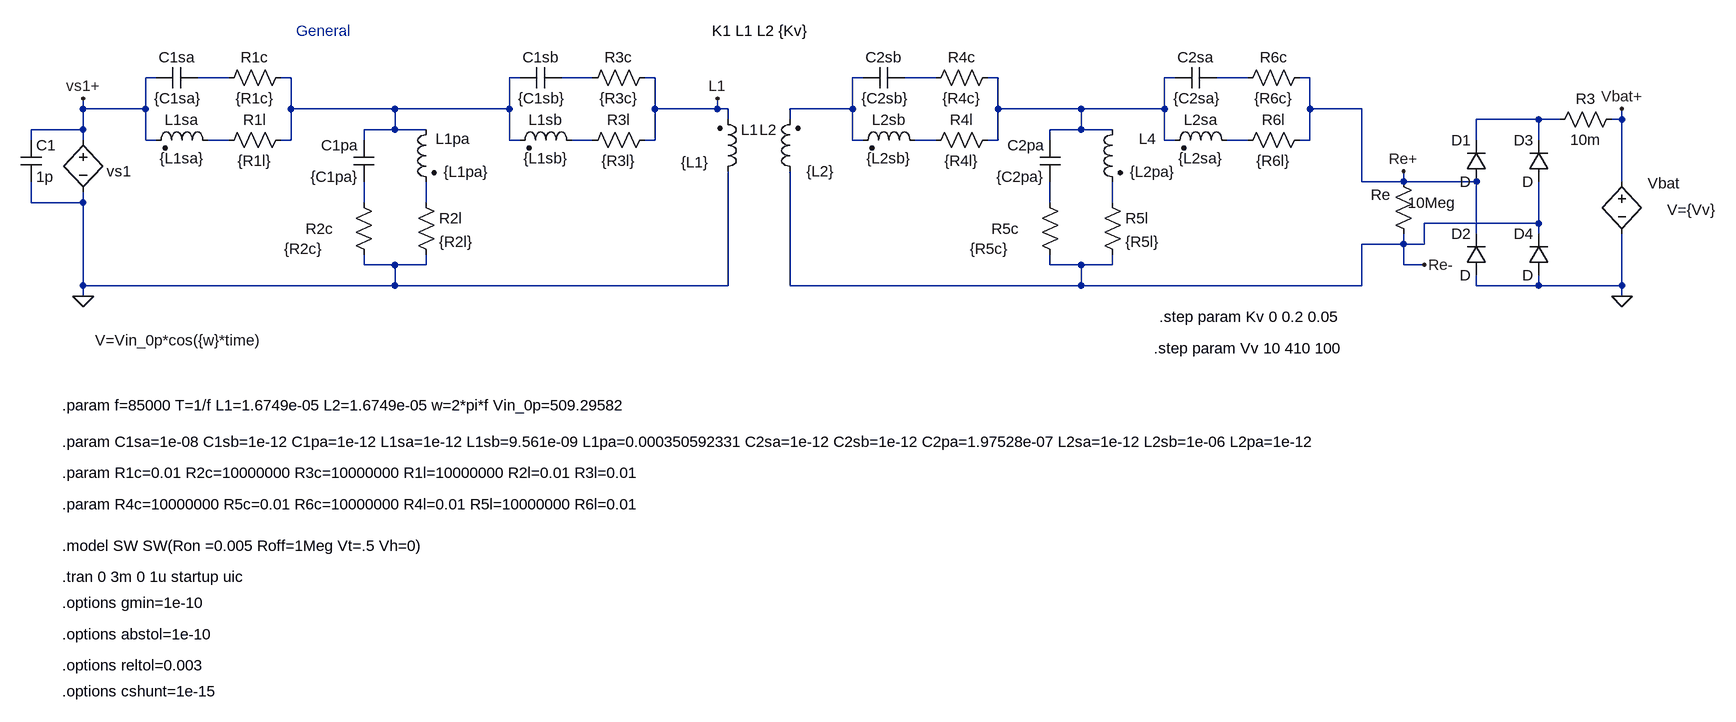
[diagram p0: schematic new_General_v4 (1).asc]
new_General_v4 (1).asc, the LTspice schematic file:
Version 4
SHEET 1 3372 844
WIRE -816 -784 -832 -784
WIRE -704 -784 -752 -784
WIRE -608 -784 -624 -784
WIRE -256 -784 -272 -784
WIRE -144 -784 -192 -784
WIRE -48 -784 -64 -784
WIRE 272 -784 256 -784
WIRE 384 -784 336 -784
WIRE 480 -784 464 -784
WIRE 752 -784 736 -784
WIRE 864 -784 816 -784
WIRE 960 -784 944 -784
WIRE -928 -736 -928 -752
WIRE -832 -736 -832 -784
WIRE -832 -736 -928 -736
WIRE -608 -736 -608 -784
WIRE -448 -736 -608 -736
WIRE -272 -736 -272 -784
WIRE -272 -736 -448 -736
WIRE -48 -736 -48 -784
WIRE 48 -736 48 -752
WIRE 48 -736 -48 -736
WIRE 64 -736 48 -736
WIRE 256 -736 256 -784
WIRE 256 -736 160 -736
WIRE 480 -736 480 -784
WIRE 608 -736 480 -736
WIRE 736 -736 736 -784
WIRE 736 -736 608 -736
WIRE 960 -736 960 -784
WIRE 1040 -736 960 -736
WIRE 64 -720 64 -736
WIRE 160 -720 160 -736
WIRE 1312 -720 1216 -720
WIRE 1344 -720 1312 -720
WIRE 1440 -720 1440 -736
WIRE 1440 -720 1424 -720
WIRE -928 -704 -928 -736
WIRE -928 -704 -1008 -704
WIRE -448 -704 -448 -736
WIRE -448 -704 -496 -704
WIRE -400 -704 -448 -704
WIRE 608 -704 608 -736
WIRE 608 -704 560 -704
WIRE 656 -704 608 -704
WIRE -1008 -688 -1008 -704
WIRE -928 -688 -928 -704
WIRE -832 -688 -832 -736
WIRE -816 -688 -832 -688
WIRE -704 -688 -736 -688
WIRE -608 -688 -608 -736
WIRE -608 -688 -624 -688
WIRE -496 -688 -496 -704
WIRE -272 -688 -272 -736
WIRE -256 -688 -272 -688
WIRE -144 -688 -176 -688
WIRE -48 -688 -48 -736
WIRE -48 -688 -64 -688
WIRE 256 -688 256 -736
WIRE 272 -688 256 -688
WIRE 384 -688 352 -688
WIRE 480 -688 480 -736
WIRE 480 -688 464 -688
WIRE 560 -688 560 -704
WIRE 736 -688 736 -736
WIRE 752 -688 736 -688
WIRE 864 -688 832 -688
WIRE 960 -688 960 -736
WIRE 960 -688 944 -688
WIRE 1216 -688 1216 -720
WIRE 1312 -688 1312 -720
WIRE 1040 -624 1040 -736
WIRE 1104 -624 1104 -640
WIRE 1104 -624 1040 -624
WIRE 1216 -624 1104 -624
WIRE 1440 -624 1440 -720
WIRE -1008 -592 -1008 -624
WIRE -928 -592 -928 -608
WIRE -928 -592 -1008 -592
WIRE -496 -592 -496 -624
WIRE -400 -592 -400 -624
WIRE 560 -592 560 -624
WIRE 656 -592 656 -624
WIRE 1312 -560 1312 -624
WIRE 1312 -560 1136 -560
WIRE 1216 -544 1216 -624
WIRE 1312 -544 1312 -560
WIRE 1104 -528 1104 -544
WIRE 1104 -528 1040 -528
WIRE 1136 -528 1136 -560
WIRE 1136 -528 1104 -528
WIRE -496 -496 -496 -512
WIRE -448 -496 -496 -496
WIRE -400 -496 -400 -512
WIRE -400 -496 -448 -496
WIRE 560 -496 560 -512
WIRE 608 -496 560 -496
WIRE 656 -496 656 -512
WIRE 656 -496 608 -496
WIRE 1104 -496 1104 -528
WIRE 1136 -496 1104 -496
WIRE -928 -464 -928 -592
WIRE -448 -464 -448 -496
WIRE -448 -464 -928 -464
WIRE 64 -464 64 -640
WIRE 64 -464 -448 -464
WIRE 160 -464 160 -640
WIRE 608 -464 608 -496
WIRE 608 -464 160 -464
WIRE 1040 -464 1040 -528
WIRE 1040 -464 608 -464
WIRE 1216 -464 1216 -480
WIRE 1312 -464 1312 -480
WIRE 1312 -464 1216 -464
WIRE 1440 -464 1440 -544
WIRE 1440 -464 1312 -464
WIRE -928 -448 -928 -464
WIRE 1440 -448 1440 -464
FLAG -928 -448 0
FLAG 48 -752 L1
FLAG -928 -752 vs1+
FLAG 1440 -448 0
FLAG 1440 -736 Vbat+
FLAG 1104 -640 Re+
FLAG 1136 -496 Re-
SYMBOL ind2 176 -624 R180
WINDOW 0 36 80 Left 2
WINDOW 3 -53 16 Left 2
SYMATTR InstName L2
SYMATTR Value {L2}
SYMATTR Type ind
SYMBOL bv -928 -704 M0
WINDOW 3 -275 324 Left 2
WINDOW 0 -74 64 Left 2
SYMATTR Value V=Vin_0p*cos({w}*time)
SYMATTR InstName vs1
SYMBOL ind2 48 -624 M180
WINDOW 0 36 80 Left 2
WINDOW 3 -56 30 Left 2
SYMATTR InstName L1
SYMATTR Value {L1}
SYMATTR Type ind
SYMBOL diode 1232 -624 R180
WINDOW 0 24 64 Left 2
WINDOW 3 24 0 Left 2
SYMATTR InstName D1
SYMBOL diode 1232 -480 R180
WINDOW 0 24 64 Left 2
WINDOW 3 24 0 Left 2
SYMATTR InstName D2
SYMBOL diode 1328 -624 R180
WINDOW 0 24 64 Left 2
WINDOW 3 24 0 Left 2
SYMATTR InstName D3
SYMBOL diode 1328 -480 R180
WINDOW 0 24 64 Left 2
WINDOW 3 24 0 Left 2
SYMATTR InstName D4
SYMBOL bv 1440 -640 M0
WINDOW 3 -144 59 Left 2
WINDOW 0 -89 18 Left 2
SYMATTR Value V={Vv}
SYMATTR InstName Vbat
SYMBOL res 1120 -528 R180
WINDOW 0 36 76 Left 2
WINDOW 3 -65 64 Left 2
SYMATTR InstName Re
SYMATTR Value 10Meg
SYMBOL cap -816 -768 R270
WINDOW 0 32 32 VTop 2
WINDOW 3 0 34 VBottom 2
SYMATTR InstName C1sa
SYMATTR Value {C1sa}
SYMBOL res 1440 -736 R90
WINDOW 0 0 56 VBottom 2
WINDOW 3 32 56 VTop 2
SYMATTR InstName R3
SYMATTR Value 10m
SYMBOL ind2 -720 -672 M270
WINDOW 0 32 56 VTop 2
WINDOW 3 4 56 VBottom 2
SYMATTR InstName L1sa
SYMATTR Value {L1sa}
SYMATTR Type ind
SYMBOL res -608 -800 R90
WINDOW 0 0 56 VBottom 2
WINDOW 3 32 56 VTop 2
SYMATTR InstName R1c
SYMATTR Value {R1c}
SYMBOL res -416 -608 R0
SYMATTR InstName R2l
SYMATTR Value {R2l}
SYMBOL cap -480 -624 R180
WINDOW 0 24 56 Left 2
WINDOW 3 24 8 Left 2
SYMATTR InstName C1pa
SYMATTR Value {C1pa}
SYMBOL ind2 -384 -720 M0
WINDOW 3 -81 81 Left 2
WINDOW 0 -52 30 Left 2
SYMATTR Value {L1pa}
SYMATTR InstName L1pa
SYMATTR Type ind
SYMBOL cap -1024 -688 R0
SYMATTR InstName C1
SYMATTR Value 1p
SYMBOL res -608 -704 R90
WINDOW 0 0 56 VBottom 2
WINDOW 3 32 56 VTop 2
SYMATTR InstName R1l
SYMATTR Value {R1l}
SYMBOL res -512 -608 R0
WINDOW 0 -74 56 Left 2
WINDOW 3 -107 87 Left 2
SYMATTR InstName R2c
SYMATTR Value {R2c}
SYMBOL cap -256 -768 R270
WINDOW 0 32 32 VTop 2
WINDOW 3 0 34 VBottom 2
SYMATTR InstName C1sb
SYMATTR Value {C1sb}
SYMBOL ind2 -160 -672 M270
WINDOW 0 32 56 VTop 2
WINDOW 3 4 56 VBottom 2
SYMATTR InstName L1sb
SYMATTR Value {L1sb}
SYMATTR Type ind
SYMBOL res -48 -800 R90
WINDOW 0 0 56 VBottom 2
WINDOW 3 32 56 VTop 2
SYMATTR InstName R3c
SYMATTR Value {R3c}
SYMBOL res -48 -704 R90
WINDOW 0 0 56 VBottom 2
WINDOW 3 32 56 VTop 2
SYMATTR InstName R3l
SYMATTR Value {R3l}
SYMBOL cap 272 -768 R270
WINDOW 0 32 32 VTop 2
WINDOW 3 0 34 VBottom 2
SYMATTR InstName C2sb
SYMATTR Value {C2sb}
SYMBOL ind2 368 -672 M270
WINDOW 0 32 56 VTop 2
WINDOW 3 4 56 VBottom 2
SYMATTR InstName L2sb
SYMATTR Value {L2sb}
SYMATTR Type ind
SYMBOL res 480 -800 R90
WINDOW 0 0 56 VBottom 2
WINDOW 3 32 56 VTop 2
SYMATTR InstName R4c
SYMATTR Value {R4c}
SYMBOL res 480 -704 R90
WINDOW 0 0 56 VBottom 2
WINDOW 3 32 56 VTop 2
SYMATTR InstName R4l
SYMATTR Value {R4l}
SYMBOL res 640 -608 R0
SYMATTR InstName R5l
SYMATTR Value {R5l}
SYMBOL cap 576 -624 R180
WINDOW 0 24 56 Left 2
WINDOW 3 24 8 Left 2
SYMATTR InstName C2pa
SYMATTR Value {C2pa}
SYMBOL ind2 672 -720 M0
WINDOW 3 -81 81 Left 2
WINDOW 0 -52 30 Left 2
SYMATTR Value {L2pa}
SYMATTR InstName L4
SYMATTR Type ind
SYMBOL res 544 -608 R0
WINDOW 0 -74 56 Left 2
WINDOW 3 -107 87 Left 2
SYMATTR InstName R5c
SYMATTR Value {R5c}
SYMBOL cap 752 -768 R270
WINDOW 0 32 32 VTop 2
WINDOW 3 0 34 VBottom 2
SYMATTR InstName C2sa
SYMATTR Value {C2sa}
SYMBOL ind2 848 -672 M270
WINDOW 0 32 56 VTop 2
WINDOW 3 4 56 VBottom 2
SYMATTR InstName L2sa
SYMATTR Value {L2sa}
SYMATTR Type ind
SYMBOL res 960 -800 R90
WINDOW 0 0 56 VBottom 2
WINDOW 3 32 56 VTop 2
SYMATTR InstName R6c
SYMATTR Value {R6c}
SYMBOL res 960 -704 R90
WINDOW 0 0 56 VBottom 2
WINDOW 3 32 56 VTop 2
SYMATTR InstName R6l
SYMATTR Value {R6l}
TEXT -960 -16 Left 2 !.tran 0 3m 0 1u startup uic
TEXT -960 -224 Left 2 !.param C1sa=1e-08 C1sb=1e-12 C1pa=1e-12 L1sa=1e-12 L1sb=9.561e-09 L1pa=0.000350592331 C2sa=1e-12 C2sb=1e-12 C2pa=1.97528e-07 L2sa=1e-12 L2sb=1e-06 L2pa=1e-12
TEXT -600 -856 Left 2 ;General
TEXT -960 -64 Left 2 !.model SW SW(Ron =0.005 Roff=1Meg Vt=.5 Vh=0)
TEXT 40 -856 Left 2 !K1 L1 L2 {Kv}
TEXT 728 -416 Left 2 !.step param Kv 0 0.2 0.05
TEXT 720 -368 Left 2 !.step param Vv 10 410 100
TEXT -960 -280 Left 2 !.param f=85000 T=1/f L1=1.6749e-05 L2=1.6749e-05 w=2*pi*f Vin_0p=509.29582
TEXT -960 -176 Left 2 !.param R1c=0.01 R2c=10000000 R3c=10000000 R1l=10000000 R2l=0.01 R3l=0.01
TEXT -960 24 Left 2 !.options gmin=1e-10
TEXT -960 72 Left 2 !.options abstol=1e-10
TEXT -960 120 Left 2 !.options reltol=0.003
TEXT -960 160 Left 2 !.options cshunt=1e-15
TEXT -960 -128 Left 2 !.param R4c=10000000 R5c=0.01 R6c=10000000 R4l=0.01 R5l=10000000 R6l=0.01

The netlist it stands for:
* new_General_v4 (1).asc
L2 Re- N004 {L2}
B§vs1 vs1+ 0 V=Vin_0p*cos({w}*time)
L1 0 L1 {L1}
D1 Re+ N008 D
D2 0 Re+ D
D3 Re- N008 D
D4 0 Re- D
B§Vbat Vbat+ 0 V={Vv}
Re Re- Re+ 10Meg
C1sa vs1+ N001 {C1sa}
R3 Vbat+ N008 10m
L1sa N009 vs1+ {L1sa}
R1c N002 N001 {R1c}
R2l N014 0 {R2l}
C1pa N013 N002 {C1pa}
L1pa N002 N014 {L1pa}
C1 vs1+ 0 1p
R1l N002 N009 {R1l}
R2c N013 0 {R2c}
C1sb N002 N003 {C1sb}
L1sb N010 N002 {L1sb}
R3c L1 N003 {R3c}
R3l L1 N010 {R3l}
C2sb N004 N005 {C2sb}
L2sb N011 N004 {L2sb}
R4c N006 N005 {R4c}
R4l N006 N011 {R4l}
R5l N016 Re- {R5l}
C2pa N015 N006 {C2pa}
L4 N006 N016 {L2pa}
R5c N015 Re- {R5c}
C2sa N006 N007 {C2sa}
L2sa N012 N006 {L2sa}
R6c Re+ N007 {R6c}
R6l Re+ N012 {R6l}
.model D D
.lib standard.dio
.tran 0 3m 0 1u startup uic
.param C1sa=1e-08 C1sb=1e-12 C1pa=1e-12 L1sa=1e-12 L1sb=9.561e-09 L1pa=0.000350592331 C2sa=1e-12 C2sb=1e-12 C2pa=1.97528e-07 L2sa=1e-12 L2sb=1e-06 L2pa=1e-12
* General
.model SW SW(Ron =0.005 Roff=1Meg Vt=.5 Vh=0)
K1 L1 L2 {Kv}
.step param Kv 0 0.2 0.05
.step param Vv 10 410 100
.param f=85000 T=1/f L1=1.6749e-05 L2=1.6749e-05 w=2*pi*f Vin_0p=509.29582
.param R1c=0.01 R2c=10000000 R3c=10000000 R1l=10000000 R2l=0.01 R3l=0.01
.options gmin=1e-10
.options abstol=1e-10
.options reltol=0.003
.options cshunt=1e-15
.param R4c=10000000 R5c=0.01 R6c=10000000 R4l=0.01 R5l=10000000 R6l=0.01
.backanno
.end